# Altium schematic sheet lo-synth.SchDoc: Clock Distribution #2
size Legal; CheckedBy: J. Brinton; CompanyName: Signal Laboratories, Inc.; DrawnBy: J. Brinton; Engineer: J. Brinton; Address1: 3479 Edison Way; Address2: Menlo Park CA 94025; Address3: +1 (877) 778-8435; Address4: siglabs.com; DocumentNumber: 5; Revision: 2b; SheetNumber: 5; SheetTotal: 58
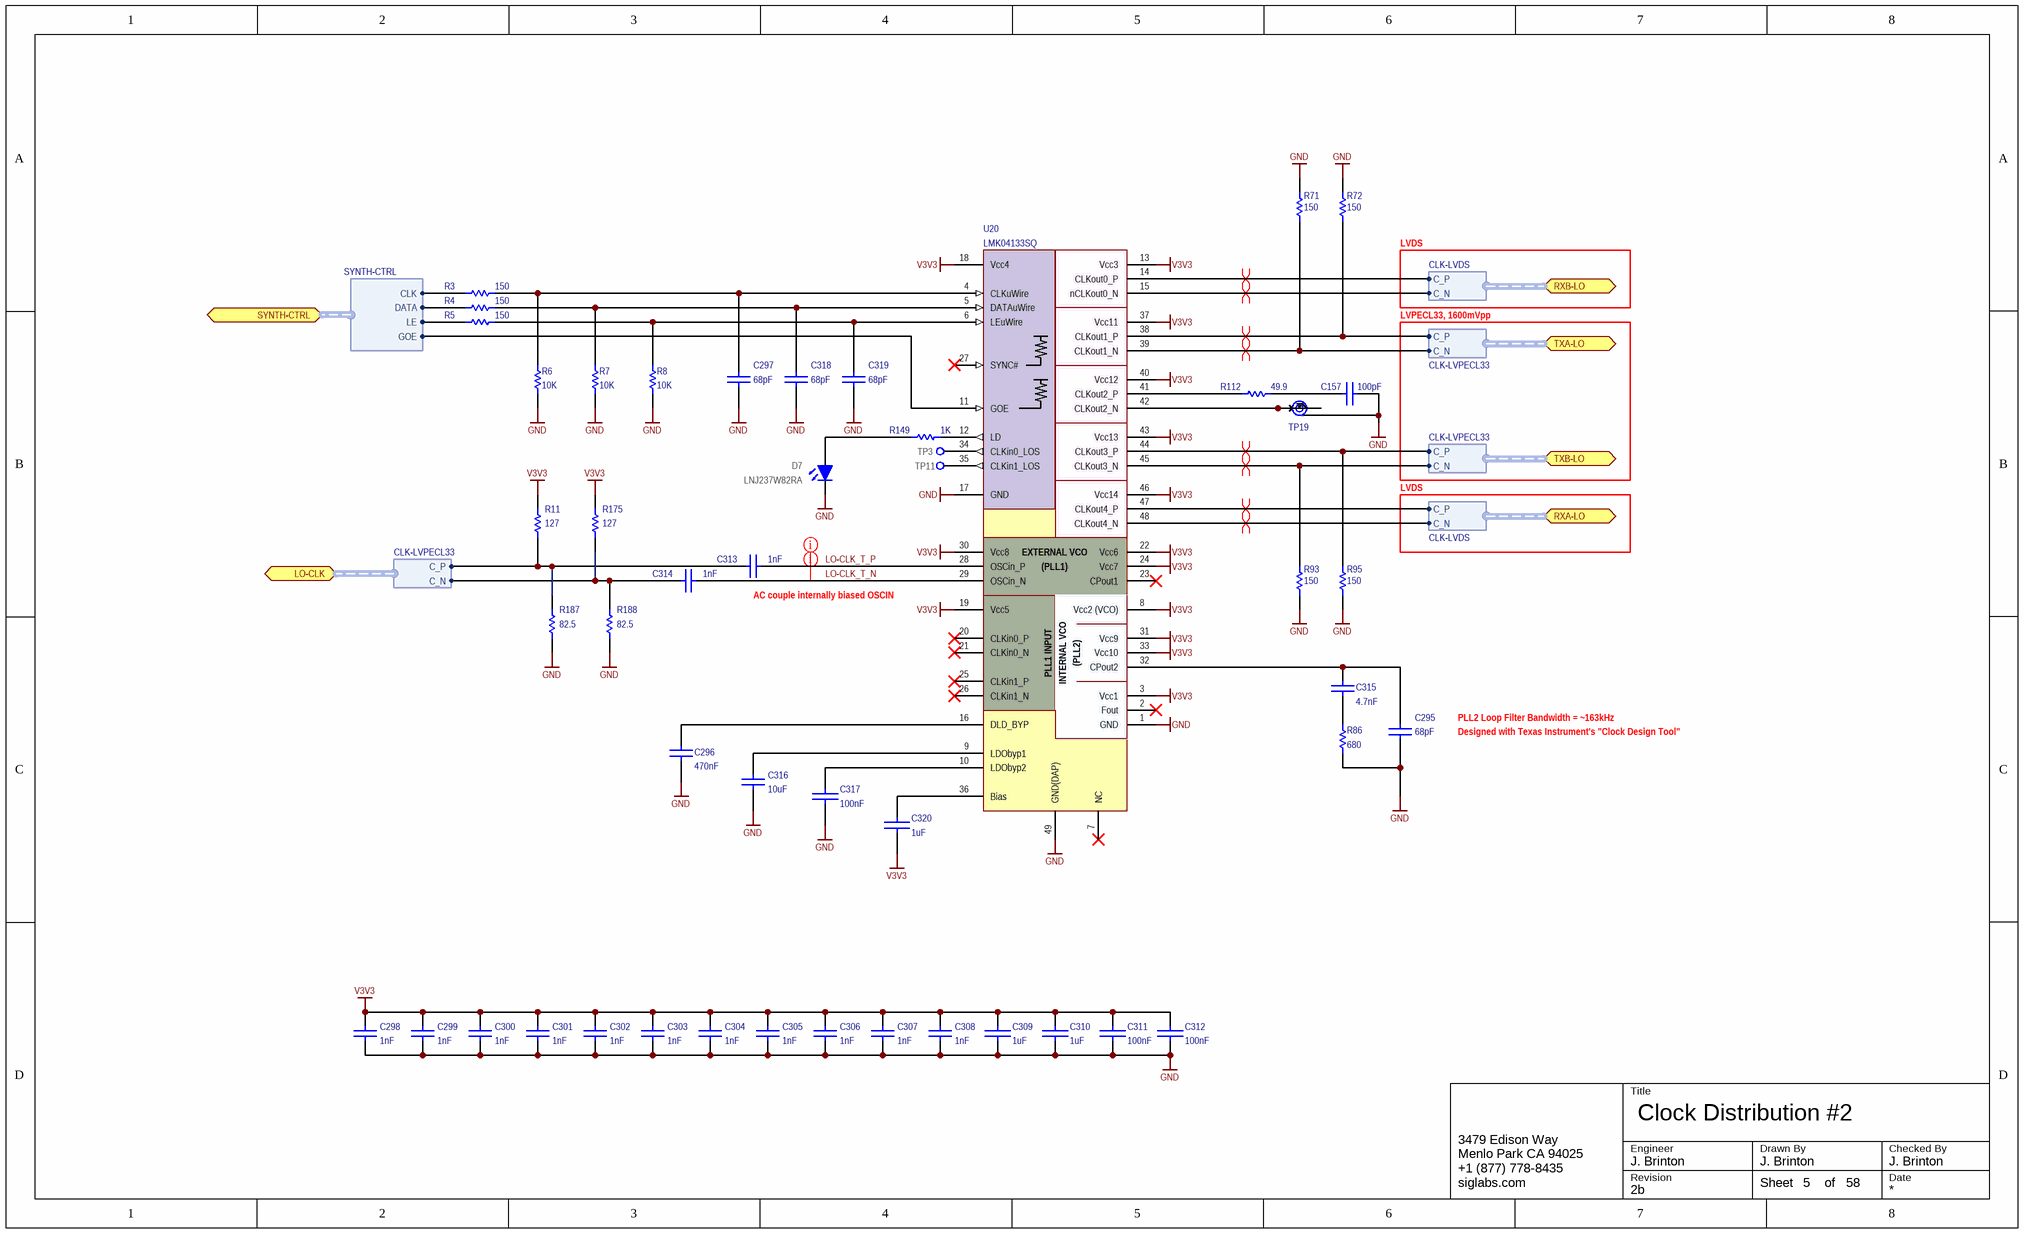
[diagram p0: lo-synth.SchDoc]

## Parts
C157  value 100pF  [0402]  (hidden comment: CBR04C101F3GAC)
C295  value 68pF  [0402]  (hidden comment: GRM1555C1H680GA01D)
C296  value 470nF  [0805]  (hidden comment: C0805C474K5RACTU)
C297  value 68pF  [0402]  (hidden comment: GRM1555C1H680GA01D)
C298  value 1nF  [0402]  (hidden comment: GRM1555C1H102JA01D)
C299  value 1nF  [0402]  (hidden comment: GRM1555C1H102JA01D)
C300  value 1nF  [0402]  (hidden comment: GRM1555C1H102JA01D)
C301  value 1nF  [0402]  (hidden comment: GRM1555C1H102JA01D)
C302  value 1nF  [0402]  (hidden comment: GRM1555C1H102JA01D)
C303  value 1nF  [0402]  (hidden comment: GRM1555C1H102JA01D)
C304  value 1nF  [0402]  (hidden comment: GRM1555C1H102JA01D)
C305  value 1nF  [0402]  (hidden comment: GRM1555C1H102JA01D)
C306  value 1nF  [0402]  (hidden comment: GRM1555C1H102JA01D)
C307  value 1nF  [0402]  (hidden comment: GRM1555C1H102JA01D)
C308  value 1nF  [0402]  (hidden comment: GRM1555C1H102JA01D)
C309  value 1uF  [0402]  (hidden comment: GRM155R61A105KE15D)
C310  value 1uF  [0402]  (hidden comment: GRM155R61A105KE15D)
C311  value 100nF  [0402]  (hidden comment: GRM155R71C104KA88J)
C312  value 100nF  [0402]  (hidden comment: GRM155R71C104KA88J)
C313  value 1nF  [0402]  (hidden comment: GRM1555C1H102JA01D)
C314  value 1nF  [0402]  (hidden comment: GRM1555C1H102JA01D)
C315  value 4.7nF  [0402]  (hidden comment: GRM155R71H472JA01D)
C316  value 10uF  [0603]  (hidden comment: CL10A106MA8NRNC)
C317  value 100nF  [0402]  (hidden comment: GRM155R71C104KA88J)
C318  value 68pF  [0402]  (hidden comment: GRM1555C1H680GA01D)
C319  value 68pF  [0402]  (hidden comment: GRM1555C1H680GA01D)
C320  value 1uF  [0402]  (hidden comment: GRM155R61A105KE15D)
D7  LNJ237W82RA  [0603_LED]
R3  value 150  [0402]  (hidden comment: ERJ-2RKF1500X)
R4  value 150  [0402]  (hidden comment: ERJ-2RKF1500X)
R5  value 150  [0402]  (hidden comment: ERJ-2RKF1500X)
R6  value 10K  [0402]  (hidden comment: ERJ-2RKF1002X)
R7  value 10K  [0402]  (hidden comment: ERJ-2RKF1002X)
R8  value 10K  [0402]  (hidden comment: ERJ-2RKF1002X)
R11  value 127  [0402]  (hidden comment: ERA-2AEB1270X)
R71  value 150  [0402]  (hidden comment: ERJ-2RKF1500X)
R72  value 150  [0402]  (hidden comment: ERJ-2RKF1500X)
R86  value 680  [0402]  (hidden comment: RC0402FR-07680RL)
R93  value 150  [0402]  (hidden comment: ERJ-2RKF1500X)
R95  value 150  [0402]  (hidden comment: ERJ-2RKF1500X)
R112  value 49.9  [0603]  (hidden comment: ERJ-3EKF49R9V)
R149  value 1K  [0402]  (hidden comment: RC0402FR-071KL)
R175  value 127  [0402]  (hidden comment: ERA-2AEB1270X)
R187  value 82.5  [0402]  (hidden comment: ERA-2AEB82R5X)
R188  value 82.5  [0402]  (hidden comment: ERA-2AEB82R5X)
TP3  TEST_POINT_SMD_10  [TEST_POINT_SMD_10]  (value not drawn)  (no BOM)
TP11  TEST_POINT_SMD_10  [TEST_POINT_SMD_10]  (value not drawn)  (no BOM)
TP19  MS-180(20)  [MS-180(20)]  (value not drawn)
U20  LMK04133SQ  [RHS]

## Ports
LO-CLK (harness CLK-LVPECL33), RXA-LO (harness CLK-LVDS), RXB-LO (harness CLK-LVDS), SYNTH-CTRL (harness SYNTH-CTRL), TXA-LO (harness CLK-LVPECL33), TXB-LO (harness CLK-LVPECL33)

## Harnesses
SYNTH-CTRL: DATA, CLK, LE, GOE
CLK-LVPECL33: C_P, C_N
CLK-LVDS: C_P, C_N

## Nets
GND: C157.2 C295.1 C296.1 C297.1 C298.1 C299.1 C300.1 C301.1 C302.1 C303.1 C304.1 C305.1 C306.1 C307.1 C308.1 C309.1 C310.1 C311.1 C312.1 C316.1 C317.1 C318.1 C319.1 D7.2(K) R6.1 R7.1 R8.1 R71.2 R72.2 R86.2 R93.1 R95.1 R187.1 R188.1 TP19.G(GND) U20.1(GND) U20.17(GND) U20.49(GND(DAP))
V3V3: C298.2 C299.2 C300.2 C301.2 C302.2 C303.2 C304.2 C305.2 C306.2 C307.2 C308.2 C309.2 C310.2 C311.2 C312.2 C320.1 R11.2 R175.2 U20.3(Vcc1) U20.8(Vcc2_(VCO)) U20.13(Vcc3) U20.18(Vcc4) U20.19(Vcc5) U20.22(Vcc6) U20.24(Vcc7) U20.30(Vcc8) U20.31(Vcc9) U20.33(Vcc10) U20.37(Vcc11) U20.40(Vcc12) U20.43(Vcc13) U20.46(Vcc14)
LO-CLK_T_N: C314.1 U20.29(OSCin_N)
LO-CLK_T_P: C313.1 U20.28(OSCin_P)
NetC157_1: C157.1 R112.2
NetC295_2: C295.2 C315.2 U20.32(CPout2)
NetC296_2: C296.2 U20.16(DLD_BYP)
NetC297_2: C297.2 R3.2 R6.2 U20.4(CLKuWire)
NetC313_2: C313.2 R11.1 R187.2 ; port LO-CLK.C_P
NetC314_2: C314.2 R175.1 R188.2 ; port LO-CLK.C_N
NetC315_1: C315.1 R86.1
NetC316_2: C316.2 U20.9(LDObyp1)
NetC317_2: C317.2 U20.10(LDObyp2)
NetC318_2: C318.2 R4.2 R7.2 U20.5(DATAuWire)
NetC319_2: C319.2 R5.2 R8.2 U20.6(LEuWire)
NetC320_2: C320.2 U20.36(Bias)
NetD7_1: D7.1(A) R149.1
NetR3_1: R3.1 ; port SYNTH-CTRL.CLK
NetR4_1: R4.1 ; port SYNTH-CTRL.DATA
NetR5_1: R5.1 ; port SYNTH-CTRL.LE
NetR71_1: R71.1 U20.39(CLKout1_N) ; port TXA-LO.C_N
NetR72_1: R72.1 U20.38(CLKout1_P) ; port TXA-LO.C_P
NetR93_2: R93.2 U20.45(CLKout3_N) ; port TXB-LO.C_N
NetR95_2: R95.2 U20.44(CLKout3_P) ; port TXB-LO.C_P
NetR112_1: R112.1 U20.41(CLKout2_P)
NetR149_2: R149.2 U20.12(LD)
NetTP3_1: TP3.1 U20.34(CLKin0_LOS)
NetTP11_1: TP11.1 U20.35(CLKin1_LOS)
NetTP19_A: TP19.A(OUT) TP19.C(IN) U20.42(CLKout2_N)
NetU20_11: U20.11(GOE) ; port SYNTH-CTRL.GOE
NetU20_14: U20.14(CLKout0_P) ; port RXB-LO.C_P
NetU20_15: U20.15(nCLKout0_N) ; port RXB-LO.C_N
NetU20_47: U20.47(CLKout4_P) ; port RXA-LO.C_P
NetU20_48: U20.48(CLKout4_N) ; port RXA-LO.C_N

Not connected (* = marked no-connect by the designer): U20 2(Fout)* 7(NC)* 20(CLKin0_P)* 21(CLKin0_N)* 23(CPout1)* 25(CLKin1_P)* 26(CLKin1_N)* 27(SYNC#)*

## Layout directives
differential pair: NetR71_1, NetR72_1, NetR93_2, NetR95_2, NetU20_14, NetU20_15, NetU20_47, NetU20_48
rule Undefined; rule Length Constraint [Min Length = 0mm    Max Length = 12.7mm]: LO-CLK_T_N, LO-CLK_T_P

## Notes on the sheet
- LVDS
- LVPECL33, 1600mVpp
- (near C313) AC couple internally biased OSCIN
- PLL2 Loop Filter Bandwidth = ~163kHz
- Designed with Texas Instrument's "Clock Design Tool"
- Title
- Engineer
- Revision
- Drawn By
- Checked By
- Date
- Sheet
- of
- (in symbol LMK04133) EXTERNAL VCO; (PLL1); PLL1 INPUT; INTERNAL VCO; (PLL2)

## Library data of the parts
C157 = CAP 0603: Ceramic Capacitor 100pF ±1% 25V NP0 0402; Manufacturer: Kemet; Tr: -55:125; Voltage: 25V; Manufacturer P/N: CBR04C101F3GAC; Package: 0402; Tolerance: ±1%
C295 C297 C318 C319 = CAP 0402: Ceramic Capacitor 68pF ±2% 50V NP0 0402; Manufacturer: Murata; Tr: -55:125; Voltage: 50V; Manufacturer P/N: GRM1555C1H680GA01D; Package: 0402; Tolerance: ±2%
C296 = CAP 0402: Ceramic Capacitor 470nF ±10% 50V X7R 0805; Manufacturer: Kemet; Tr: -55:125; Voltage: 50V; Manufacturer P/N: C0805C474K5RACTU; Package: 0805; Tolerance: ±10%
C298-C308 C313 C314 = CAP 0402: Ceramic Capacitor 1nF ±5% 50V NP0 0402; Manufacturer: Murata; Tr: -55:125; Voltage: 50V; Manufacturer P/N: GRM1555C1H102JA01D; Package: 0402; Tolerance: ±5%
C309 C310 C320 = CAP: Ceramic Capacitor 1uF ±10% 10V X5R 0402; Manufacturer: Murata; Tr: -55:125; Manufacturer P/N: GRM155R61A105KE15D; Package: 0402; Tolerance: ±10%; Voltage: 10V
C311 C312 C317 = CAP: Ceramic Capacitor 100nF ±10% 16V X7R 0402; Manufacturer: Murata; Tr: -55:125; Manufacturer P/N: GRM155R71C104KA88J; Voltage: 16V; Package: 0402; Tolerance: ±10%
C315 = CAP 0402: Ceramic Capacitor 4.7nF ±5% 50V X7R 0402; Manufacturer: Murata; Tr: -55:125; Voltage: 50V; Manufacturer P/N: GRM155R71H472JA01D; Package: 0402; Tolerance: ±5%
C316 = CAP 0402: Ceramic Capacitor 10uF ±20% 25V X5R 0603; Manufacturer: Samsung; Tr: -55:85; Voltage: 25V; Manufacturer P/N: CL10A106MA8NRNC; Package: 0603; Tolerance: ±20%
D7 = LED0603RD: LED, SMT 0603, Color Red, 5mA, 1.85V; Manufacturer: Panasonic; Manufacturer P/N: LNJ237W82RA; Package: 0603 Polarized
R3-R5 R71 R72 R93 R95 = RES 0402: Thick Film 150 ±1% 0402; Manufacturer: Panasonic; Tr: -55:155; Package: 0402; Manufacturer P/N: ERJ-2RKF1500X; Do Not Place: *; Tolerance: ±1%
R6-R8 = RES 0402: Thick Film 10k ±1% 0402; Manufacturer: Panasonic; Tr: -55:155; Package: 0402; Manufacturer P/N: ERJ-2RKF1002X; Tolerance: ±1%
R11 R175 = RES 0402: Thin Film Resistor 127 ±0.1% 0402; Manufacturer: Panasonic; Tr: -55:155; Package: 0402; Manufacturer P/N: ERA-2AEB1270X; Do Not Place: *; Tolerance: ±0.1%
R86 = RES 0402: Thick Film Resistor 680 ±1% 0402; Manufacturer: Yageo; Tr: -55:155; Manufacturer P/N: RC0402FR-07680RL; Do Not Place: *; Package: 0402; Tolerance: ±1%
R112 = RES 0603: Thick Film Resistor 49.9 ±1% 0603; Manufacturer: Panasonic; Tr: -55:155; Package: 0603; Manufacturer P/N: ERJ-3EKF49R9V; Tolerance: ±1%
R149 = RES 0402: Thick Film Resistor 1k ±1% 0402; Manufacturer: Yageo; Tr: -55:155; Package: 0402; Manufacturer P/N: RC0402FR-071KL; Do Not Place: *; Tolerance: ±1%
R187 R188 = RES 0402: Thin Film Resistor 82.5 ±0.1% 0402; Manufacturer: Panasonic; Tr: -55:155; Package: 0402; Manufacturer P/N: ERA-2AEB82R5X; Do Not Place: *; Tolerance: ±0.1%
TP3 TP11 = TEST_POINT_SMD_10: Test Point SMD
TP19 = MS-180(20): Coaxial Connector Switch; Manufacturer: Hirose; Manufacturer P/N: MS-180(20)
U20 = LMK04133: Clock Jitter Cleaner with Cascaded PLLs; Manufacturer: Texas Instruments; Manufacturer P/N: LMK04133SQ